# Altium schematic sheet LoPoSwitch-BLE.SchDoc
size 251 x 345 mm
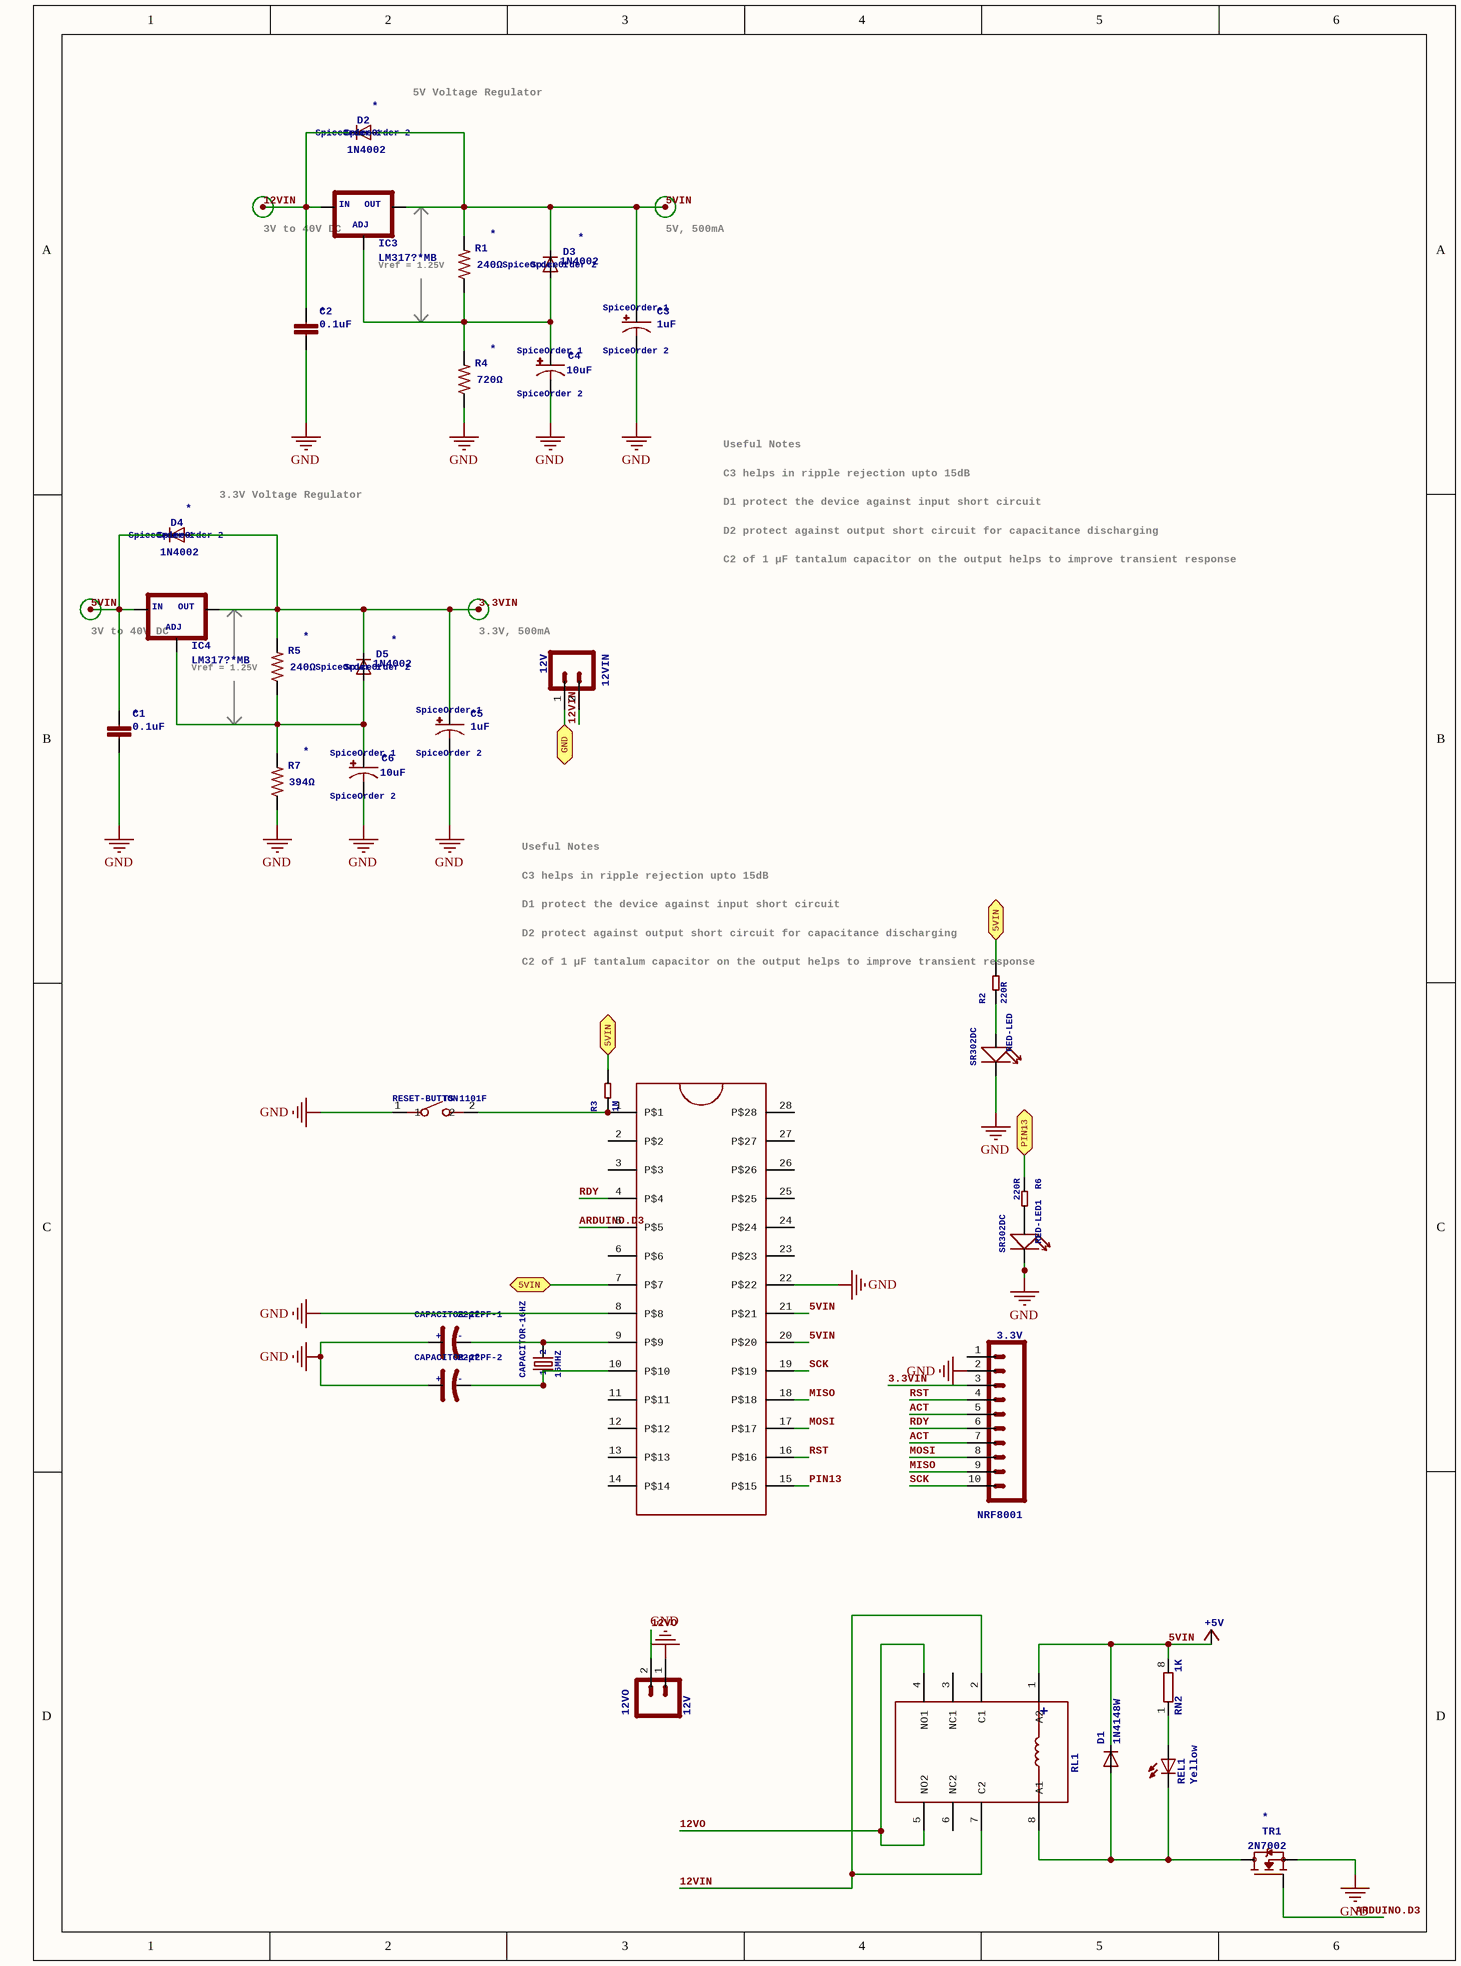
[diagram p0: LoPoSwitch-BLE.SchDoc]

## Parts
5VIN  +5V
12VIN  12V  [JST-2-PTH]
12VO  12V  [JST-2-PTH]
ATMEGA328  ZIFSOCKET-28-3ZIFFSOCKET-28-3  [DIL28-3-ZIF_SOCKET]  (value not drawn)
C1  0.1uF  [C075-052X106]
C2  0.1uF  [C075-052X106]
C3  1uF  SpiceOrder1: SpiceOrder 1  SpiceOrder2: SpiceOrder 2  [085CS_1AR]
C4  10uF  SpiceOrder1: SpiceOrder 1  SpiceOrder2: SpiceOrder 2  [085CS_1AR]
C5  1uF  SpiceOrder1: SpiceOrder 1  SpiceOrder2: SpiceOrder 2  [085CS_1AR]
C6  10uF  SpiceOrder1: SpiceOrder 1  SpiceOrder2: SpiceOrder 2  [085CS_1AR]
CAPACITOR-16HZ  16MHZ  [HC49US]
CAPACITOR-22PF-1  22pf  [PC-D5.3MM]
CAPACITOR-22PF-2  22pf  [PC-D5.3MM]
D1  1N4148W  [SOD123]
D2  1N4002  SpiceOrder1: SpiceOrder 1  SpiceOrder2: SpiceOrder 2  [DO41-10]
D3  1N4002  SpiceOrder1: SpiceOrder 1  SpiceOrder2: SpiceOrder 2  [DO41-10]
D4  1N4002  SpiceOrder1: SpiceOrder 1  SpiceOrder2: SpiceOrder 2  [DO41-10]
D5  1N4002  SpiceOrder1: SpiceOrder 1  SpiceOrder2: SpiceOrder 2  [DO41-10]
IC3  LM317?*MB  [TO220L1]
IC4  LM317?*MB  [TO220L1]
NRF8001  3.3V  [1X10]
R1  240Ω  [M0805]
R2  220R  [PR-D2.3XL6.5MM]
R3  1M  [PR-D2.3XL6.5MM]
R4  720Ω  [M0805]
R5  240Ω  [M0805]
R6  220R  [PR-D2.3XL6.5MM]
R7  394Ω  [M0805]
RED-LED  SR302DC  [LED2-2.54-D3.0MM]
RED-LED1  SR302DC  [LED2-2.54-D3.0MM]
REL1  Yellow  [CHIPLED_0805]
RESET-BUTTON  TS-1101F  [SW2-5.0-6.0X3.0X4.3MM]
RL1  G5V-2-H1  [RELE'-30SSERIES-DIL-2X]  (value not drawn)
RN2  1K  [CAY16]
TR1  2N7002  [SOT-23]

## Ports
5VIN, GND, PIN13

## Nets
GND: 12VO.1 ATMEGA328.8(P$8) ATMEGA328.22(P$22) C1.2 C2.2 C3.- C4.- C5.- C6.- CAPACITOR-22PF-1.+ CAPACITOR-22PF-2.+ NRF8001.2 R4.1 R7.1 RED-LED.K(-) RED-LED1.K(-) RESET-BUTTON.1 TR1.2(S)
3.3VIN: C5.+ D4.A D5.C IC4.2(OUT) NRF8001.3 R5.2
5VIN: ATMEGA328.7(P$7) R2.2 R3.2 ; port 5VIN
5VIN: 5VIN.?1(+5V) ATMEGA328.20(P$20) ATMEGA328.21(P$21) C1.1 C3.+ D1.C D2.A D3.C D4.C IC3.2(OUT) IC4.3(IN) R1.2 RL1.1(A2) RN2.8  [a separate net that carries the same name]
12VIN: 12VIN.2 C2.1 D2.C IC3.3(IN) RL1.2(C1) RL1.7(C2)
12VO: 12VO.2 RL1.4(NO1) RL1.5(NO2)
ACT: NRF8001.5 NRF8001.7
ARDUINO.D3: ATMEGA328.5(P$5) TR1.3(G)
GND: 12VIN.1 ; port GND  [a separate net that carries the same name]
MISO: ATMEGA328.18(P$18) NRF8001.9
MOSI: ATMEGA328.17(P$17) NRF8001.8
PIN13: ATMEGA328.15(P$15)
PIN13: R6.1 ; port PIN13  [a separate net that carries the same name]
RDY: ATMEGA328.4(P$4) NRF8001.6
RST: ATMEGA328.16(P$16) NRF8001.4
SCK: ATMEGA328.19(P$19) NRF8001.10
NetATMEGA328_1: ATMEGA328.1(P$1) R3.1 RESET-BUTTON.2
NetATMEGA328_9: ATMEGA328.9(P$9) CAPACITOR-16HZ.2 CAPACITOR-22PF-1.-
NetATMEGA328_10: ATMEGA328.10(P$10) CAPACITOR-16HZ.1 CAPACITOR-22PF-2.-
NetC4_+: C4.+ D3.A IC3.1(ADJ) R1.1 R4.2
NetC6_+: C6.+ D5.A IC4.1(ADJ) R5.1 R7.2
NetD1_A: D1.A REL1.C RL1.8(A1) TR1.1(D)
NetR2_1: R2.1 RED-LED.A(+)
NetR6_2: R6.2 RED-LED1.A(+)
NetREL1_A: REL1.A RN2.1

Not connected (* = marked no-connect by the designer): ATMEGA328 2(P$2) 3(P$3) 6(P$6) 11(P$11) 12(P$12) 13(P$13) 14(P$14) 23(P$23) 24(P$24) 25(P$25) 26(P$26) 27(P$27) 28(P$28); NRF8001 1; RL1 3(NC1) 6(NC2)

## Notes on the sheet
- 5V Voltage Regulator
- 3V to 40V DC
- Vref = 1.25V
- 5V, 500mA
- C3 helps in ripple rejection upto 15dB
- Useful Notes
- 3.3V Voltage Regulator
- D1 protect the device against input short circuit
- D2 protect against output short circuit for capacitance discharging
- C2 of 1 µF tantalum capacitor on the output helps to improve transient response
- (near 12VIN) 3.3V, 500mA

## Library data of the parts
5VIN = +5V: SUPPLY SYMBOL; GateName_1: 1; SymbolName_1: +5V; LibraryName: supply1; DeviceSetName: +5V
12VIN 12VO = M02JST-PTH-2: Standard 2-pin 0.1" header. Use with  - straight break away headers ( PRT-00116) - right angle break away headers (PRT-00553) - swiss pins (PRT-00743) - machine pins (PRT-00117) - female headers (PRT-00115)   Molex polarized connector foot print use with: PRT-08233 with associated crimp pins and housings.  2.54_SCREWTERM for use with  PRT-10571.  3.5mm Screw Terminal footprints for  PRT-08084  5mm Screw Terminal footprints for use with PRT-08432; GateName_1: G$1; SymbolName_1: M02; PROD_ID: CONN-09863; DeviceName: JST-PTH-2; LibraryName: SparkFun-Connectors; DeviceSetName: M02; MF: *; MPN: *; OC_FARNELL: unknown; SKU: PRT-09914
ATMEGA328 = ZIFSOCKET-28-3ZIFFSOCKET-28-3: Lever-action ZIF socket for 28-pin ICs; GateName_1: G$1; SymbolName_1: DIL-28-3; DeviceName: ZIFFSOCKET-28-3; LibraryName: SparkFun-Connectors; DeviceSetName: ZIFSOCKET-28-3; MF: *; MPN: *; OC_FARNELL: unknown
C1 C2 = C-EU075-052X106: CAPACITOR, European symbol; GateName_1: G$1; SymbolName_1: C-EU; DeviceName: 075-052X106; LibraryName: rcl; DeviceSetName: C-EU; NAME: *
C3-C6 = CPOL-US085CS-1AR: POLARIZED CAPACITOR, American symbol; GateName_1: G$1; SymbolName_1: CPOL-US; DeviceName: 085CS-1AR; LibraryName: resistor; DeviceSetName: CPOL-US; NAME: *
CAPACITOR-16HZ = DIP-CRYSTAL-16MHZ-18PF-30PPM-50R(HC49US): 306010037; GateName_1: G$1; SymbolName_1: CRYSTAL; LibraryName: Seeed-Crystal Oscillator; DeviceSetName: DIP-CRYSTAL-16MHZ-18PF-30PPM-50R(HC49US); MF: *; MPN: *; OC_FARNELL: unknown; 1: 1; 2: 2
CAPACITOR-22PF-1 CAPACITOR-22PF-2 = DIP-ALUMINUM-47UF-16V(D5-H7MM): 302030033; GateName_1: G$1; SymbolName_1: CAP-POLAR; LibraryName: Seeed-Capacitor; DeviceSetName: DIP-ALUMINUM-47UF-16V(D5-H7MM); MF: *; MPN: *; OC_FARNELL: unknown; +: +; -: -
D1 = 0290_1N4148W: FAST SMALL SIGNAL DIODES SMD 200mA 100V SOD123; GateName_1: G$1; SymbolName_1: D; MONTHLY_USAGE: _____; TYPE: Diodi; LibraryName: Diodi; DeviceSetName: 0290_1N4148W; CASE: SOD123; PART_NUMBER: 1N4148W; PRICE: _____; SUPPLIER: _____
D2-D5 = 1N4004: DIODE   general purpose rectifier, 1 A; GateName_1: 1; SymbolName_1: D; LibraryName: diode; DeviceSetName: 1N4004; NAME: *
IC3 IC4 = LM317?*MB: 500 mA Adjustable Output Positive Voltage Regulator   Source: http://www.onsemi.co.jp .. LM317M-D.PDF; GateName_1: G$1; SymbolName_1: 78ADJ; DeviceName: MB; LibraryName: Texas Instruments_By_element14_Batch_1; DeviceSetName: LM317?*; ADJ: ADJ; IN: IN; OUT: OUT
NRF8001 = M10SILK_FEMALE_PTH: Header 10Standard 10-pin 0.1" header. Use with straight break away headers (SKU : PRT-00116), right angle break away headers (PRT-00553), swiss pins (PRT-00743), machine pins (PRT-00117), and female headers (PRT-00115).; GateName_1: G$1; SymbolName_1: M10; PROD_ID: CONN-11563; DeviceName: SILK_FEMALE_PTH; LibraryName: SparkFun-Connectors; DeviceSetName: M10; MF: *; MPN: *; OC_FARNELL: unknown
R1 R4 R5 R7 = R-US_M0805: RESISTOR, American symbol; GateName_1: G$1; SymbolName_1: R-US; DeviceSetName: R-US_; DeviceName: M0805; LibraryName: resistor; NAME: *
R2 R6 = DIP-RES-220R-5%-1/4W(PR-D2.3XL6.5MM): 301020011; GateName_1: G$1; SymbolName_1: RES; LibraryName: Seeed-Resistor; DeviceSetName: DIP-RES-220R-5%-1/4W(PR-D2.3XL6.5MM); MF: *; MPN: *; OC_FARNELL: unknown
R3 = DIP-RES-1M-5%-1/4W(PR-D2.3XL6.5MM): 301020005; GateName_1: G$1; SymbolName_1: RES; LibraryName: Seeed-Resistor; DeviceSetName: DIP-RES-1M-5%-1/4W(PR-D2.3XL6.5MM); MF: *; MPN: *; OC_FARNELL: unknown
RED-LED RED-LED1 = DIP-LED-RED-RED(2P-D3MM): 304090041; GateName_1: G$1; SymbolName_1: LED-1; LibraryName: Seeed-LED; DeviceSetName: DIP-LED-RED-RED(2P-D3MM); MF: *; MPN: *; OC_FARNELL: unknown
REL1 = 0044_KPT-2012YC: LED YELLOW - SMD - 0805; GateName_1: G$1; MONTHLY_USAGE: _____; SymbolName_1: LED; LibraryName: Opto; DeviceSetName: 0044_KPT-2012YC; CASE: *; PART_NUMBER: KPT-2012YC; PRICE: _____; SUPPLIER: _____; TYPE: Opto
RESET-BUTTON = DIP-BUTTON(2P-6.0X3.0X4.3MM)-TS-1101F: 311020025; GateName_1: G$1; SymbolName_1: BUTTON-2P; DeviceName: -TS-1101F; LibraryName: Seeed-Switch; DeviceSetName: DIP-BUTTON(2P-6.0X3.0X4.3MM); MF: *; MPN: *; OC_FARNELL: unknown
RL1 = 1045_G5V-2-H1: Rel� 5V nero Omron; GateName_1: G$1; SymbolName_1: RELE-2X; MONTHLY_USAGE: _____; LibraryName: Rele'; DeviceSetName: 1045_G5V-2-H1; CASE: *; PART_NUMBER: G5V-2-H1; PRICE: _____; SUPPLIER: _____; TYPE: Rele'; +: +
RN2 = 0005_064R_1K_/_CAY16-102J4LF: 1K 064R; GateName_1: A; SymbolName_1: R1NV; MONTHLY_USAGE: _____; LibraryName: Resistenze; DeviceSetName: 0005_064R_1K_/_CAY16-102J4LF; CASE: SMD_3,2x1,6; PART_NUMBER: 064R_1K_/_CAY16-102J4LF; PRICE: _____; SUPPLIER: _____; TYPE: Resistenze
TR1 = 1612_2N7002LT1G: 2N7002 60 V, 300 mA N-channel Trench MOSFET; GateName_1: G$1; SymbolName_1: N-MOSFET; LibraryName: Transistors; DeviceSetName: 1612_2N7002LT1G; NAME: *